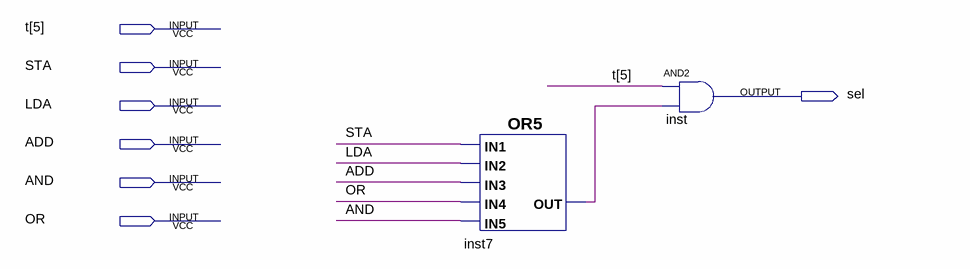
[diagram p0: schematic sheet]
// Quartus schematic sel_LOGIC.bdf as structural Verilog: 2 symbols, 7 pins
module sel_LOGIC (
  input  [5:5] t,
  input  STA,
  input  LDA,
  input  ADD,
  input  AND,
  input  OR,
  output sel
);

  wire inst7_out;

  or inst7 (inst7_out, STA, LDA, ADD, OR, AND);
  and inst (sel, t[5], inst7_out);
endmodule
